# EAGLE schematic schematic (EAGLE 8.6.0)
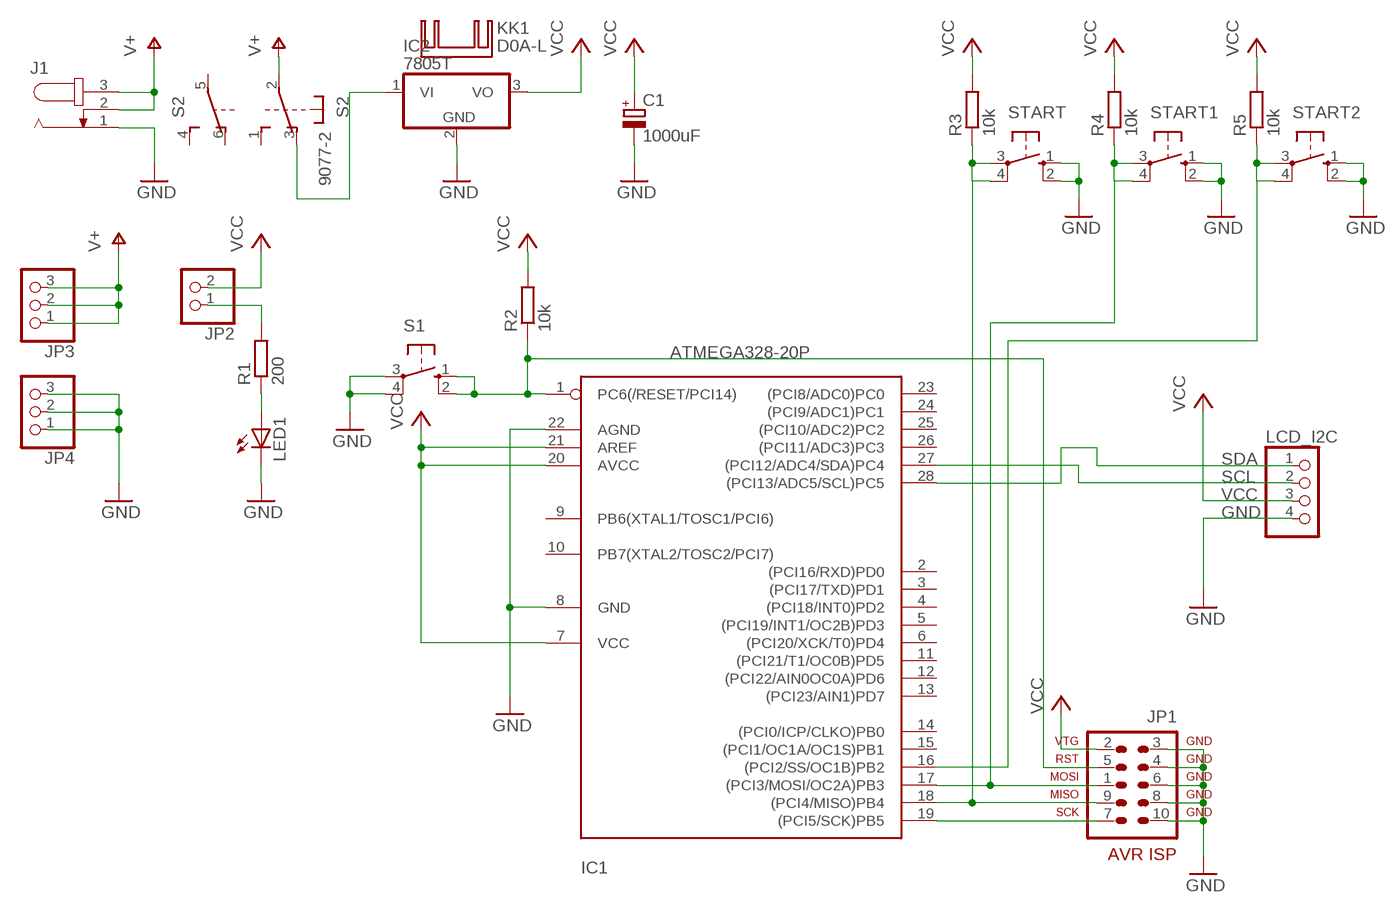
[diagram p0: schematic, sheet 1]

## Parts
C1  1000uF  CPOL-EUE3.5-10  [E3,5-10]
IC1  ATMEGA328-20P  [DIL28-3]
IC2  7805T  [TO220H]
J1  JACK-PLUG0  [SPC4077]
JP1  AVR-ISP-10  [AVR-ISP-10]
JP2  PINHD-1X2  [1X02]
JP3  PINHD-1X3  [1X03]
JP4  PINHD-1X3  [1X03]
KK1  D0A-L  [D02A-L]
LCD_I2C  PINHD-1X4  [1X04]
LED1  LED5MM  [LED5MM]
R1  200  R-EU_0207/10  [0207/10]
R2  10k  R-EU_0207/10  [0207/10]
R3  10k  R-EU_0207/10  [0207/10]
R4  10k  R-EU_0207/10  [0207/10]
R5  10k  R-EU_0207/10  [0207/10]
S1  10-XX  [B3F-10XX]
S2  9077-2  [9077-2]
START  10-XX  [B3F-10XX]
START1  10-XX  [B3F-10XX]
START2  10-XX  [B3F-10XX]

## Nets
GND: C1.- IC1.8(GND) IC1.22(AGND) IC2.2(GND) J1.1 JP1.3 JP1.4 JP1.6 JP1.8 JP1.10 JP4.1 JP4.2 JP4.3 LCD_I2C.4 LED1.K(C) S1.3(P) S1.4(P1) START1.1(S) START1.2(S1) START2.1(S) START2.2(S1) START.1(S) START.2(S1)
N$1: IC2.1(VI) S2.3(1:O)
N$2: JP2.1 R1.2
N$3: LED1.A R1.1
N$4: IC1.1(PC6(/RESET/PCI14)) JP1.5 R2.1 S1.1(S) S1.2(S1)
N$5: IC1.18((PCI4/MISO)PB4) JP1.9 R3.1 START.3(P) START.4(P1)
N$9: IC1.17((PCI3/MOSI/OC2A)PB3) JP1.1 R4.1 START1.3(P) START1.4(P1)
N$10: IC1.16((PCI2/SS/OC1B)PB2) R5.1 START2.3(P) START2.4(P1)
N$13: IC1.19((PCI5/SCK)PB5) JP1.7
SCL: IC1.27((PCI12/ADC4/SDA)PC4) LCD_I2C.2
SDA: IC1.28((PCI13/ADC5/SCL)PC5) LCD_I2C.1
V+: J1.2 J1.3 JP3.1 JP3.2 JP3.3 S2.2(1:P)
VCC: C1.+ IC1.7(VCC) IC1.20(AVCC) IC1.21(AREF) IC2.3(VO) JP1.2 JP2.2 LCD_I2C.3 R2.2 R3.2 R4.2 R5.2
Unconnected: IC1.2((PCI16/RXD)PD0) IC1.3((PCI17/TXD)PD1) IC1.4((PCI18/INT0)PD2) IC1.5((PCI19/INT1/OC2B)PD3) IC1.6((PCI20/XCK/T0)PD4) IC1.9(PB6(XTAL1/TOSC1/PCI6)) IC1.10(PB7(XTAL2/TOSC2/PCI7)) IC1.11((PCI21/T1/OC0B)PD5) IC1.12((PCI22/AIN0OC0A)PD6) IC1.13((PCI23/AIN1)PD7) IC1.14((PCI0/ICP/CLKO)PB0) IC1.15((PCI1/OC1A/OC1S)PB1) IC1.23((PCI8/ADC0)PC0) IC1.24((PCI9/ADC1)PC1) IC1.25((PCI10/ADC2)PC2) IC1.26((PCI11/ADC3)PC3) S2.1(1:S) S2.4(2:S) S2.5(2:P) S2.6(2:O)

## Library data of the parts
C1 = rcl:CPOL-EU: POLARIZED CAPACITOR, European symbol; SPICEPREFIX: C
IC1 = atmega328:ATMEGA328*P: MICROCONTROLLER 32 kBytes FLASH 2 kBytes SRAM 1 kBytes EEPROM USART 8-channel 10 bit ADC
IC2 = linear:78*: Positive VOLTAGE REGULATOR Source: http://cache.national.com/ds/LM/LM78L05.pdf http://www.fairchildsemi.com/ds/LM/LM7805.pdf
J1 = con-jack:JACK-PLUG: DC POWER JACK Power Jack, DC, Right Angle, Through Hole, Rated 5A at 16VDC, PC Terminals Distributor: Farnell (www.Farnell.de) Drawing: 84N1161.pdf / 84N1162.pdf Manufacturer: SPC Technology (www.spctechnology.com) Type: SPC4077 / SPC 4078; OC_FARNELL: unknown; OC_NEWARK: unknown
JP1 = avr-7:AVR-ISP-10: AVR ISP-10 Serial Programming Header
JP2 = pinhead:PINHD-1X2: PIN HEADER
JP3 JP4 = pinhead:PINHD-1X3: PIN HEADER
KK1 = heatsink:D0A-L: HEATSINK distributor Schukat
LCD_I2C = pinhead:PINHD-1X4: PIN HEADER
LED1 = led:LED: LED OSRAM: - CHIPLED LG R971, LG N971, LY N971, LG Q971, LY Q971, LO R971, LY R971 LH N974, LH R974 LS Q976, LO Q976, LY Q976 LO Q996 - Hyper CHIPLED LW Q18S LB Q993, LB Q99A, LB R99A - SideLED LS A670, LO A670, LY A670, LG A670, LP A670 LB A673, LV A673, LT A673, LW A673 LH A674 LY A675 LS A676, LA A676, LO A676, LY A676, LW A676 LS A679, LY A679, LG A679 - Hyper Micro SIDELED® LS Y876, LA Y876, LO Y876, LY Y876 LT Y87S - SmartLED LW L88C, LW L88S LB L89C, LB L89S, LG L890 LS L89K, LO L89K, LY L89K LS L896, LA L896, LO L896, LY L896 - TOPLED LS T670, LO T670, LY T670, LG T670, LP T670 LSG T670, LSP T670, LSY T670, LOP T670, LYG T670 LG T671, LOG T671, LSG T671 LB T673, LV T673, LT T673, LW T673 LH T674 LS T676, LA T676, LO T676, LY T676, LB T676, LH T676, LSB T676, LW T676 LB T67C, LV T67C, LT T67C, LS T67K, LO T67K, LY T67K, LW E67C LS E67B, LA E67B, LO E67B, LY E67B, LB E67C, LV E67C, LT E67C LW T67C LS T679, LY T679, LG T679 LS T770, LO T770, LY T770, LG T770, LP T770 LB T773, LV T773, LT T773, LW T773 LH T774 LS E675, LA E675, LY E675, LS T675 LS T776, LA T776, LO T776, LY T776, LB T776 LHGB T686 LT T68C, LB T68C - Hyper Mini TOPLED® LB M676 - Mini TOPLED Santana® LG M470 LS M47K, LO M47K, LY M47K Source: http://www.osram.convergy.de LUXEON: - LUMILED® LXK2-PW12-R00, LXK2-PW12-S00, LXK2-PW14-U00, LXK2-PW14-V00 LXK2-PM12-R00, LXK2-PM12-S00, LXK2-PM14-U00 LXK2-PE12-Q00, LXK2-PE12-R00, LXK2-PE12-S00, LXK2-PE14-T00, LXK2-PE14-U00 LXK2-PB12-K00, LXK2-PB12-L00, LXK2-PB12-M00, LXK2-PB14-N00, LXK2-PB14-P00, LXK2-PB14-Q00 LXK2-PR12-L00, LXK2-PR12-M00, LXK2-PR14-Q00, LXK2-PR14-R00 LXK2-PD12-Q00, LXK2-PD12-R00, LXK2-PD12-S00 LXK2-PH12-R00, LXK2-PH12-S00 LXK2-PL12-P00, LXK2-PL12-Q00, LXK2-PL12-R00 Source: www.luxeon.com KINGBRIGHT: KA-3528ASYC Source: www.kingbright.com
R1-R5 = resistor:R-EU_: RESISTOR, European symbol
S1 START START1 START2 = switch-omron:10-XX: OMRON SWITCH; MPN: B3F-1000; OC_FARNELL: 176432; OC_NEWARK: 36M3542
S2 = switch-misc:9077-2: MARQUARDT SWITCH 9077.0200 Distributor: Buerklin <https://www.buerklin.com/default.asp?event=ShowArtikel%2812G2822%29&l=d&jump=ArtNr_12G2822>